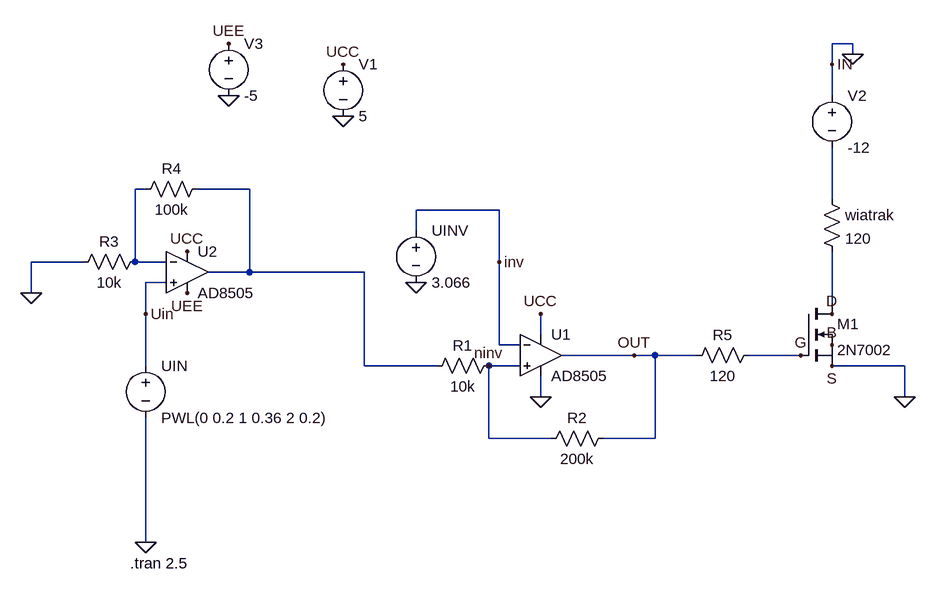
[diagram p0: schematic Praca_domowa_lab5.asc]
Praca_domowa_lab5.asc, the LTspice schematic file:
Version 4.1
SHEET 1 1764 1044
WIRE 1440 -336 1408 -336
WIRE 1440 -320 1440 -336
WIRE 1408 -304 1408 -336
WIRE 1408 -256 1408 -304
WIRE 352 -112 336 -112
WIRE 512 -112 432 -112
WIRE 1408 -96 1408 -176
WIRE 896 -80 768 -80
WIRE 768 -48 768 -80
WIRE 256 0 176 0
WIRE 336 0 336 -112
WIRE 384 0 336 0
WIRE 896 0 896 -80
WIRE 512 16 512 -112
WIRE 512 16 448 16
WIRE 688 16 512 16
WIRE 384 32 352 32
WIRE 176 48 176 0
WIRE 1408 64 1408 -16
WIRE 352 80 352 32
WIRE 960 112 960 80
WIRE 896 128 896 0
WIRE 928 128 896 128
WIRE 1104 144 992 144
WIRE 1136 144 1104 144
WIRE 1200 144 1136 144
WIRE 1360 144 1280 144
WIRE 352 160 352 80
WIRE 688 160 688 16
WIRE 800 160 688 160
WIRE 928 160 880 160
WIRE 1520 160 1408 160
WIRE 960 208 960 176
WIRE 1520 208 1520 160
WIRE 880 272 880 160
WIRE 976 272 880 272
WIRE 1136 272 1136 144
WIRE 1136 272 1056 272
WIRE 352 432 352 240
FLAG 656 -224 0
FLAG 656 -304 UCC
FLAG 960 208 0
FLAG 960 80 UCC
FLAG 1104 144 OUT
FLAG 768 32 0
FLAG 896 0 inv
FLAG 352 432 0
FLAG 880 160 ninv
FLAG 176 48 0
FLAG 352 80 Uin
FLAG 416 48 UEE
FLAG 416 -16 UCC
FLAG 1440 -320 0
FLAG 1520 208 0
FLAG 1408 -304 IN
FLAG 1408 80 D
FLAG 1408 160 S
FLAG 1360 144 G
FLAG 1408 128 B
FLAG 480 -256 0
FLAG 480 -336 UEE
SYMBOL voltage 656 -320 R0
WINDOW 123 0 0 Left 0
WINDOW 39 0 0 Left 0
SYMATTR InstName V1
SYMATTR Value 5
SYMBOL voltage 352 144 R0
WINDOW 123 0 0 Left 0
WINDOW 39 0 0 Left 0
SYMATTR InstName UIN
SYMATTR Value PWL(0 0.2 1 0.36 2 0.2)
SYMBOL res 1072 256 R90
WINDOW 0 0 56 VBottom 2
WINDOW 3 32 56 VTop 2
SYMATTR InstName R2
SYMATTR Value 200k
SYMBOL OpAmps\\AD8505 960 80 R0
SYMATTR InstName U1
SYMBOL res 896 144 R90
WINDOW 0 0 56 VBottom 2
WINDOW 3 32 56 VTop 2
SYMATTR InstName R1
SYMATTR Value 10k
SYMBOL voltage 768 -64 R0
WINDOW 123 0 0 Left 0
WINDOW 39 0 0 Left 0
SYMATTR InstName UINV
SYMATTR Value 3.066
SYMBOL res 352 -16 R90
WINDOW 0 0 56 VBottom 2
WINDOW 3 32 56 VTop 2
SYMATTR InstName R3
SYMATTR Value 10k
SYMBOL res 448 -128 R90
WINDOW 0 0 56 VBottom 2
WINDOW 3 32 56 VTop 2
SYMATTR InstName R4
SYMATTR Value 100k
SYMBOL res 1296 128 R90
WINDOW 0 0 56 VBottom 2
WINDOW 3 32 56 VTop 2
SYMATTR InstName R5
SYMATTR Value 120
SYMBOL nmos 1360 64 R0
SYMATTR InstName M1
SYMATTR Value 2N7002
SYMBOL OpAmps\\AD8505 416 -48 R0
SYMATTR InstName U2
SYMBOL voltage 480 -352 R0
WINDOW 123 0 0 Left 0
WINDOW 39 0 0 Left 0
SYMATTR InstName V3
SYMATTR Value -5
SYMBOL res 1392 -112 R0
SYMATTR InstName wiatrak
SYMATTR Value 120
SYMBOL voltage 1408 -272 R0
SYMATTR InstName V2
SYMATTR Value -12
TEXT 328 464 Left 2 !.tran 2.5

The netlist it stands for:
* Praca_domowa_lab5.asc
V1 UCC 0 5
V§UIN Uin 0 PWL(0 0.2 1 0.36 2 0.2)
R2 OUT ninv 200k
X§U1 ninv inv UCC 0 OUT AD8505  ; pins In+ In- V+ V- OUT
R1 ninv N002 10k
V§UINV inv 0 3.066
R3 N001 0 10k
R4 N002 N001 100k
R5 G OUT 120
M1 N004 G 0 0 2N7002
X§U2 Uin N001 UCC UEE N002 AD8505  ; pins In+ In- V+ V- OUT
V3 UEE 0 -5
R§wiatrak N003 N004 120
V2 0 N003 -12
.model NMOS NMOS
.model PMOS PMOS
.lib standard.mos
.tran 2.5
.backanno
.end